# EAGLE design untitled (EAGLE 9.5.0)
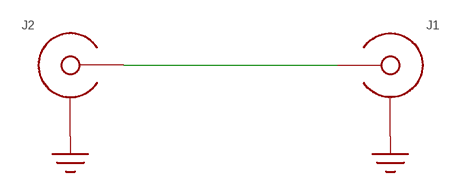
[diagram p0: schematic, sheet 1]

## Parts
J1  SMA-EDGE-LAUNCH4L-4020-TAPER-FIXED  [SMA_EDGE_LAUNCH_4L_4020_TAPER_FIXED]
J2  SMA-EDGE-LAUNCH4L-4020-TAPER-FIXED  [SMA_EDGE_LAUNCH_4L_4020_TAPER_FIXED]

## Nets
GND: J1.BOTTOM_GND(SHIELD) J1.GND@1(SHIELD) J1.GND@2(SHIELD) J1.GND@3(SHIELD) J1.GND@4(SHIELD) J1.GND@5(SHIELD) J1.GND@6(SHIELD) J1.GND@7(SHIELD) J1.GND@8(SHIELD) J1.GND@14(SHIELD) J1.GND@15(SHIELD) J1.GND@16(SHIELD) J1.GND@17(SHIELD) J1.GND_PAD1(SHIELD) J1.GND_PAD2(SHIELD) J1.P$1(SHIELD) J1.P$2(SHIELD) J2.BOTTOM_GND(SHIELD) J2.GND@1(SHIELD) J2.GND@2(SHIELD) J2.GND@3(SHIELD) J2.GND@4(SHIELD) J2.GND@5(SHIELD) J2.GND@6(SHIELD) J2.GND@7(SHIELD) J2.GND@8(SHIELD) J2.GND@14(SHIELD) J2.GND@15(SHIELD) J2.GND@16(SHIELD) J2.GND@17(SHIELD) J2.GND_PAD1(SHIELD) J2.GND_PAD2(SHIELD) J2.P$1(SHIELD) J2.P$2(SHIELD)
N$1 [13.4/6]: J1.CENTER@1(CENTER) J1.P$3(CENTER) J2.CENTER@1(CENTER) J2.P$3(CENTER)

## Library data of the parts
J1 J2 = yapo:SMA-EDGE-LAUNCH

## Board
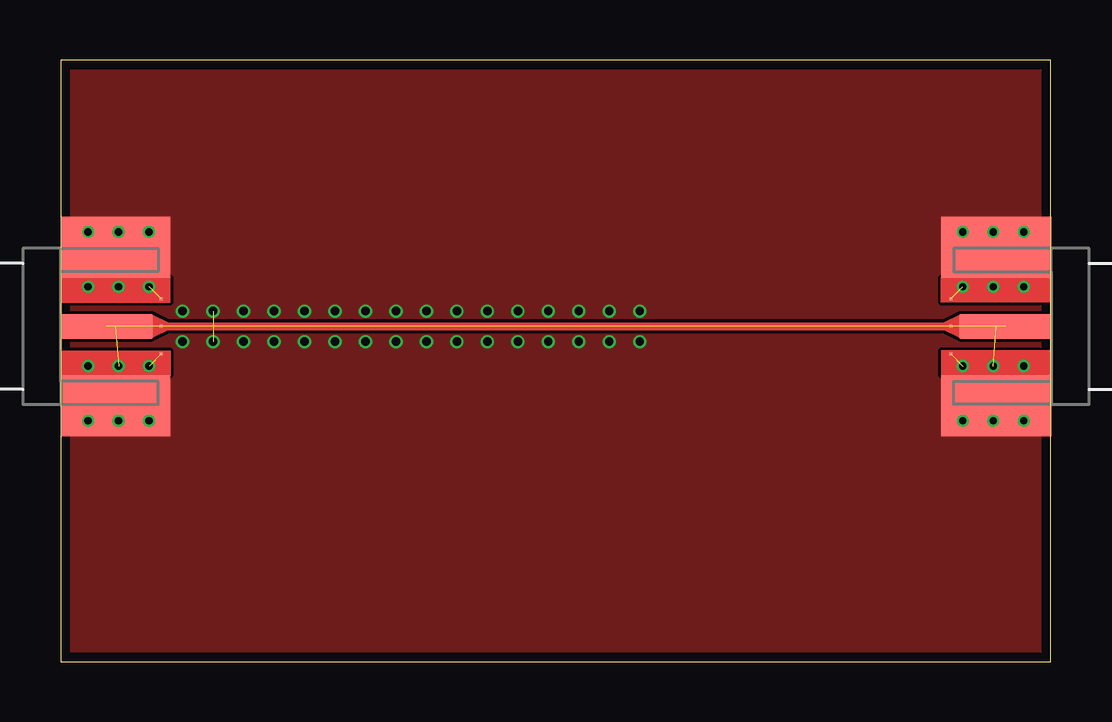
[diagram p1: board, top side]
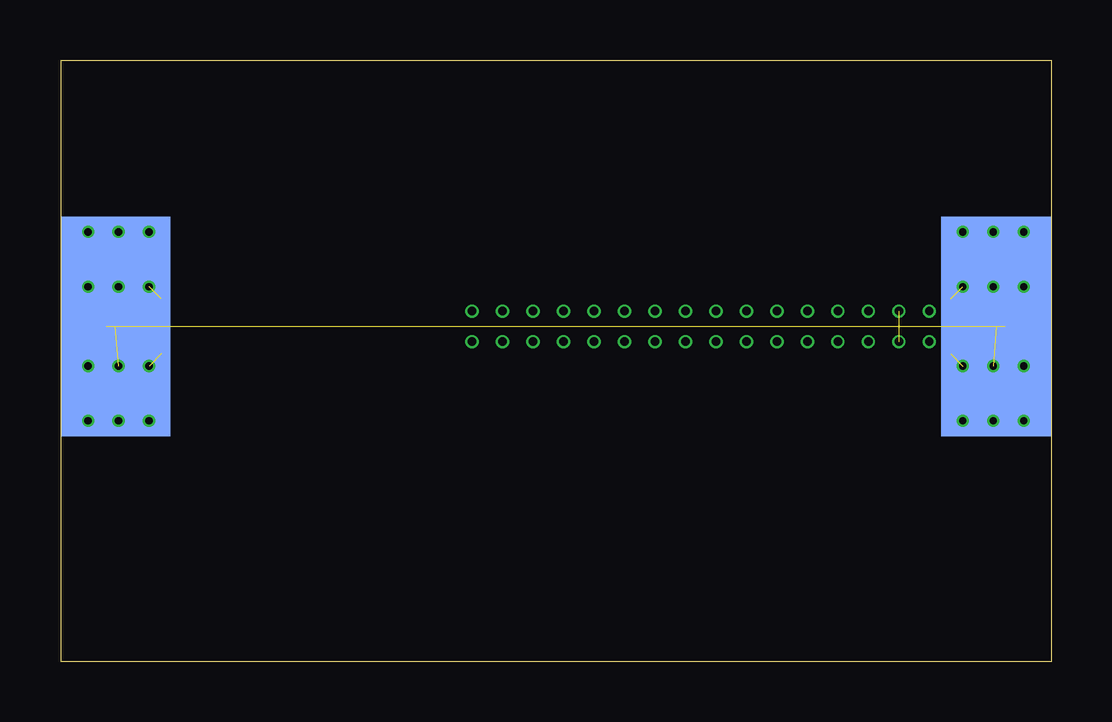
[diagram p2: board, bottom side, seen from below]

Size 41.26 x 25.07 mm. Coordinates in mm from the lower left corner, seen from the top.
Outline: 0,0 41.26,0 41.26,25.07 0,25.07 0,0
Copper layers (1*2*15*16): Top 0.035559375mm / dielectric 0.17018125mm / Route2 0.01778125mm / dielectric 47mil / Route15 0.01778125mm / dielectric 0.17018125mm / Bottom 0.035559375mm
Design rules "oshpark-4layer": minimum track width 5mil, minimum drill 10mil, track to track 5mil, track to pad 5mil, pad to pad 5mil, via to via 5mil, smd to smd 5mil, copper to edge 15mil, drill to drill 6mil, minimum pad ring 4mil, minimum via ring 4mil, stop-mask expansion 2.5mil, vias tented up to drill 0mil, thermal gap 10mil

### Footprints (pad centres in the part's own frame; a part is rotated, then mirrored left to right if it is on the bottom)
SMA_EDGE_LAUNCH_4L_4020_TAPER_FIXED = smd 4.572 x 9.144 bottom: BOTTOM_GND 2.286,0 | smd 3.81 x 1.016: CENTER@1 1.905,0 | drill 0.3: GND@1 1.143,3.937; GND@2 3.683,3.937; GND@3 1.143,1.651; GND@4 3.683,1.651; GND@5 1.143,-1.651; GND@6 3.683,-1.651; GND@7 1.143,-3.937; GND@8 3.683,-3.937; GND@14 2.413,3.937; GND@15 2.413,-3.937; GND@16 2.413,-1.651; GND@17 2.413,1.651 | smd 4.572 x 2.54: GND_PAD1 2.286,3.302; GND_PAD2 2.286,-3.302 | smd 0.127 x 0.127: P$1 4.191,1.143; P$2 4.191,-1.143; P$3 4.191,0

### Placement (x,y rotation side)
J1  0,13.97 0 top
J2  41.27,13.97 180 top

### Tracks (layer width: path | path; a pad name or v marks a point on that pad's centre or on a via)
GND  (via drill 0.35)  (7 unrouted)
  other vias: 5.08,14.61 5.08,13.34 6.35,14.61 6.35,13.34 7.62,13.34 8.89,13.34 7.62,14.61 8.89,14.61 10.16,14.61 10.16,13.34 11.43,13.34 11.43,14.61 12.7,14.61 12.7,13.34 13.97,13.34 13.97,14.61 15.24,14.61 15.24,13.34 16.51,13.34 16.51,14.61 17.78,14.61 17.78,13.34 19.05,13.34 19.05,14.61 20.32,14.61 20.32,13.34 21.59,13.34 21.59,14.61 22.86,14.61 22.86,13.34 24.13,13.34 24.13,14.61
  pour Top (no thermals): 0,0 0,25.4 41.27,25.4 41.27,0
N$1  (3 unrouted)
  Top 0.34: J1.CENTER@1 J2.CENTER@1

### Text on the board
Document: 6 mil gap | 13.4 mil trace | 13.77 mil via